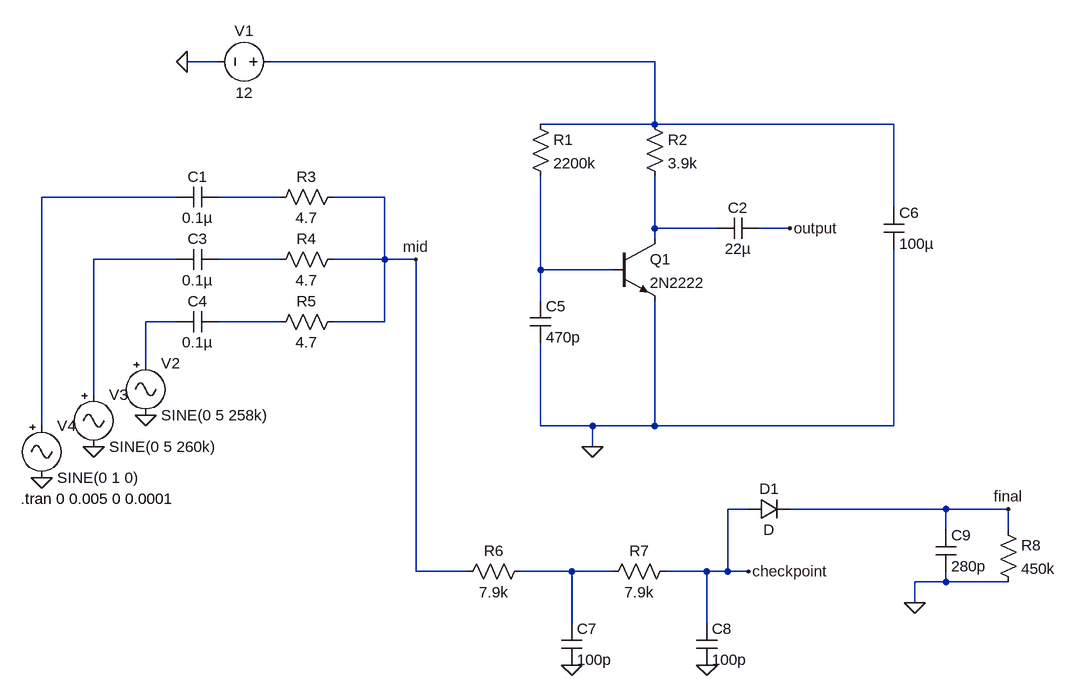
[diagram p0: schematic mixer2.asc]
mixer2.asc, the LTspice schematic file:
Version 4
SHEET 1 2720 924
WIRE -768 -80 -816 -80
WIRE -96 -80 -688 -80
WIRE -96 16 -96 -80
WIRE -96 16 -272 16
WIRE 272 16 -96 16
WIRE -832 128 -1040 128
WIRE -672 128 -768 128
WIRE -512 128 -592 128
WIRE 272 144 272 16
WIRE -96 176 -96 96
WIRE 0 176 -96 176
WIRE 112 176 64 176
WIRE -96 192 -96 176
WIRE -832 224 -960 224
WIRE -672 224 -768 224
WIRE -512 224 -512 128
WIRE -512 224 -592 224
WIRE -464 224 -512 224
WIRE -272 240 -272 96
WIRE -160 240 -272 240
WIRE -272 288 -272 240
WIRE -832 320 -880 320
WIRE -672 320 -768 320
WIRE -512 320 -512 224
WIRE -512 320 -592 320
WIRE -880 384 -880 320
WIRE -960 432 -960 224
WIRE -1040 480 -1040 128
WIRE -272 480 -272 352
WIRE -192 480 -272 480
WIRE -96 480 -96 288
WIRE -96 480 -192 480
WIRE 272 480 272 208
WIRE 272 480 -96 480
WIRE -192 512 -192 480
WIRE 48 608 16 608
WIRE 352 608 112 608
WIRE 448 608 352 608
WIRE 352 640 352 608
WIRE 448 640 448 608
WIRE -464 704 -464 224
WIRE -384 704 -464 704
WIRE -224 704 -304 704
WIRE -160 704 -224 704
WIRE -16 704 -80 704
WIRE 16 704 16 608
WIRE 16 704 -16 704
WIRE 48 704 16 704
WIRE 352 720 352 704
WIRE 352 720 304 720
WIRE 448 720 352 720
WIRE 304 752 304 720
WIRE -224 784 -224 704
WIRE -16 784 -16 704
FLAG -816 -80 0
FLAG -192 512 0
FLAG 112 176 output
FLAG -880 464 0
FLAG -960 512 0
FLAG -1040 560 0
FLAG -464 224 mid
FLAG -224 848 0
FLAG -16 848 0
FLAG 48 704 checkpoint
FLAG 304 752 0
FLAG 448 608 final
SYMBOL res -288 0 R0
SYMATTR InstName R1
SYMATTR Value 2200k
SYMBOL res -112 0 R0
SYMATTR InstName R2
SYMATTR Value 3.9k
SYMBOL res -576 112 R90
WINDOW 0 0 56 VBottom 2
WINDOW 3 32 56 VTop 2
SYMATTR InstName R3
SYMATTR Value 4.7
SYMBOL res -576 208 R90
WINDOW 0 0 56 VBottom 2
WINDOW 3 32 56 VTop 2
SYMATTR InstName R4
SYMATTR Value 4.7
SYMBOL res -576 304 R90
WINDOW 0 0 56 VBottom 2
WINDOW 3 32 56 VTop 2
SYMATTR InstName R5
SYMATTR Value 4.7
SYMBOL npn -160 192 R0
SYMATTR InstName Q1
SYMATTR Value 2N2222
SYMBOL cap -768 112 R90
WINDOW 0 0 32 VBottom 2
WINDOW 3 32 32 VTop 2
SYMATTR InstName C1
SYMATTR Value 0.1µ
SYMBOL cap 64 160 R90
WINDOW 0 0 32 VBottom 2
WINDOW 3 32 32 VTop 2
SYMATTR InstName C2
SYMATTR Value 22µ
SYMBOL cap -768 208 R90
WINDOW 0 0 32 VBottom 2
WINDOW 3 32 32 VTop 2
SYMATTR InstName C3
SYMATTR Value 0.1µ
SYMBOL cap -768 304 R90
WINDOW 0 0 32 VBottom 2
WINDOW 3 32 32 VTop 2
SYMATTR InstName C4
SYMATTR Value 0.1µ
SYMBOL cap -288 288 R0
SYMATTR InstName C5
SYMATTR Value 470p
SYMBOL cap 256 144 R0
SYMATTR InstName C6
SYMATTR Value 100µ
SYMATTR SpiceLine V=16
SYMBOL voltage -672 -80 R90
WINDOW 0 -32 56 VBottom 2
WINDOW 3 32 56 VTop 2
WINDOW 123 0 0 Left 0
WINDOW 39 0 0 Left 0
SYMATTR InstName V1
SYMATTR Value 12
SYMBOL Misc\\signal -880 368 R0
WINDOW 123 0 0 Left 0
WINDOW 39 0 0 Left 0
SYMATTR InstName V2
SYMATTR Value SINE(0 5 258k)
SYMBOL Misc\\signal -960 416 R0
WINDOW 123 0 0 Left 0
WINDOW 39 0 0 Left 0
SYMATTR InstName V3
SYMATTR Value SINE(0 5 260k)
SYMBOL Misc\\signal -1040 464 R0
WINDOW 123 0 0 Left 0
WINDOW 39 0 0 Left 0
SYMATTR InstName V4
SYMATTR Value SINE(0 1 0)
SYMBOL cap -240 784 R0
SYMATTR InstName C7
SYMATTR Value 100p
SYMBOL cap -32 784 R0
SYMATTR InstName C8
SYMATTR Value 100p
SYMBOL res -288 688 R90
WINDOW 0 0 56 VBottom 2
WINDOW 3 32 56 VTop 2
SYMATTR InstName R6
SYMATTR Value 7.9k
SYMBOL res -64 688 R90
WINDOW 0 0 56 VBottom 2
WINDOW 3 32 56 VTop 2
SYMATTR InstName R7
SYMATTR Value 7.9k
SYMBOL diode 48 624 R270
WINDOW 0 32 32 VTop 2
WINDOW 3 0 32 VBottom 2
SYMATTR InstName D1
SYMBOL cap 336 640 R0
SYMATTR InstName C9
SYMATTR Value 280p
SYMBOL res 432 624 R0
SYMATTR InstName R8
SYMATTR Value 450k
TEXT -1072 592 Left 2 !.tran 0 0.005 0 0.0001

The netlist it stands for:
* mixer2.asc
R1 N001 N007 2200k
R2 N001 N004 3.9k
R3 mid N003 4.7
R4 mid N006 4.7
R5 mid N009 4.7
Q1 N004 N007 0 0 2N2222
C1 N003 N002 0.1µ
C2 output N004 22µ
C3 N006 N005 0.1µ
C4 N009 N008 0.1µ
C5 N007 0 470p
C6 N001 0 100µ V=16
V1 N001 0 12
V2 N008 0 SINE(0 5 258k)
V3 N005 0 SINE(0 5 260k)
V4 N002 0 SINE(0 1 0)
C7 N010 0 100p
C8 checkpoint 0 100p
R6 N010 mid 7.9k
R7 checkpoint N010 7.9k
D1 checkpoint final D
C9 final 0 280p
R8 final 0 450k
.model D D
.lib standard.dio
.model NPN NPN
.model PNP PNP
.lib standard.bjt
.tran 0 0.005 0 0.0001
.backanno
.end